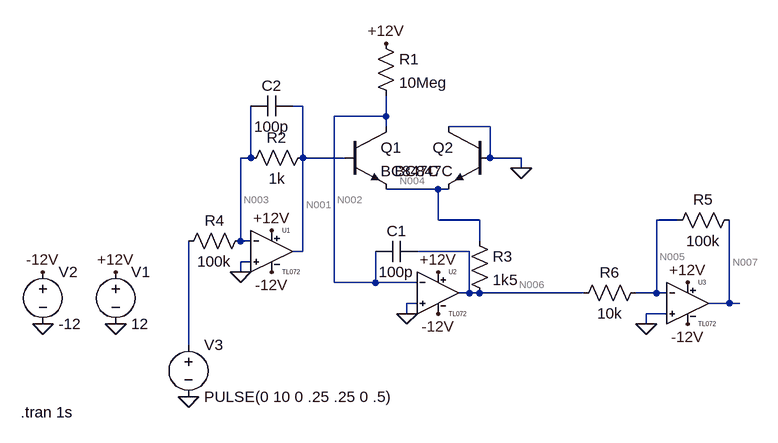
[diagram p0: schematic Draft2.asc]
Draft2.asc, the LTspice schematic file:
Version 4
SHEET 1 880 680
WIRE 32 -192 16 -192
WIRE 160 -176 160 -208
WIRE 160 -176 80 -176
WIRE 160 -160 160 -176
WIRE 320 -160 256 -160
WIRE -48 -112 -48 -192
WIRE -48 -112 -64 -112
WIRE 32 -112 32 -192
WIRE 96 -112 32 -112
WIRE 320 -112 320 -160
WIRE 368 -112 320 -112
WIRE 368 -96 368 -112
WIRE 240 -64 160 -64
WIRE 256 -64 240 -64
WIRE 240 -16 240 -64
WIRE 304 -16 240 -16
WIRE 608 -16 576 -16
WIRE -64 16 -64 -112
WIRE -48 16 -64 16
WIRE 304 16 304 -16
WIRE 32 32 32 -112
WIRE 32 32 16 32
WIRE 288 32 208 32
WIRE -48 48 -64 48
WIRE -64 64 -64 48
WIRE 80 80 80 -176
WIRE 144 80 144 32
WIRE 144 80 80 80
WIRE 208 80 144 80
WIRE 288 96 288 32
WIRE 288 96 272 96
WIRE 304 96 288 96
WIRE 464 96 304 96
WIRE 576 96 576 -16
WIRE 576 96 544 96
WIRE 592 96 576 96
WIRE 208 112 192 112
WIRE 688 112 688 -16
WIRE 688 112 656 112
WIRE 704 112 688 112
WIRE 192 128 192 112
WIRE 592 128 560 128
WIRE 560 144 560 128
WIRE -144 176 -144 16
FLAG -16 0 +12V
FLAG -16 64 -12V
FLAG -64 64 0
FLAG 240 64 +12V
FLAG 240 128 -12V
FLAG -256 144 0
FLAG -256 64 +12V
FLAG -368 64 -12V
FLAG -368 144 0
FLAG -144 256 0
FLAG 368 -96 0
FLAG 160 -288 +12V
FLAG 192 128 0
FLAG 560 144 0
FLAG 624 144 -12V
FLAG 624 80 +12V
SYMBOL TL072 -16 -32 R0
SYMATTR InstName U1
SYMBOL TL072 240 32 R0
SYMATTR InstName U2
SYMBOL voltage -256 48 R0
WINDOW 123 0 0 Left 0
WINDOW 39 0 0 Left 0
SYMATTR InstName V1
SYMATTR Value 12
SYMBOL voltage -368 48 R0
WINDOW 123 0 0 Left 0
WINDOW 39 0 0 Left 0
SYMATTR InstName V2
SYMATTR Value -12
SYMBOL voltage -144 160 R0
WINDOW 123 0 0 Left 0
WINDOW 39 0 0 Left 0
SYMATTR InstName V3
SYMATTR Value PULSE(0 10 0 .25 .25 0 .5)
SYMBOL npn 96 -160 R0
SYMATTR InstName Q1
SYMATTR Value BC847C
SYMBOL npn 320 -160 M0
SYMATTR InstName Q2
SYMATTR Value BC847C
SYMBOL res 144 -304 R0
SYMATTR InstName R1
SYMATTR Value 10Meg
SYMBOL res 48 -128 R90
WINDOW 0 0 56 VBottom 2
WINDOW 3 32 56 VTop 2
SYMATTR InstName R2
SYMATTR Value 1k
SYMBOL res 288 0 R0
SYMATTR InstName R3
SYMATTR Value 1k5
SYMBOL cap 208 16 R90
WINDOW 0 0 32 VBottom 2
WINDOW 3 32 32 VTop 2
SYMATTR InstName C1
SYMATTR Value 100p
SYMBOL cap 16 -208 R90
WINDOW 0 0 32 VBottom 2
WINDOW 3 32 32 VTop 2
SYMATTR InstName C2
SYMATTR Value 100p
SYMBOL res -48 0 R90
WINDOW 0 0 56 VBottom 2
WINDOW 3 32 56 VTop 2
SYMATTR InstName R4
SYMATTR Value 100k
SYMBOL TL072 624 48 R0
SYMATTR InstName U3
SYMBOL res 704 -32 R90
WINDOW 0 0 56 VBottom 2
WINDOW 3 32 56 VTop 2
SYMATTR InstName R5
SYMATTR Value 100k
SYMBOL res 560 80 R90
WINDOW 0 0 56 VBottom 2
WINDOW 3 32 56 VTop 2
SYMATTR InstName R6
SYMATTR Value 10k
TEXT -402 280 Left 2 !.tran 1s

The netlist it stands for:
* Draft2.asc
XU1 0 N003 +12V -12V N001 TL072  ; pins In+ In- V+ V- OUT
XU2 0 N002 +12V -12V N006 TL072  ; pins In+ In- V+ V- OUT
V1 +12V 0 12
V2 -12V 0 -12
V3 N008 0 PULSE(0 10 0 .25 .25 0 .5)
Q1 N002 N001 N004 0 BC847C
Q2 0 0 N004 0 BC847C
R1 +12V N002 10Meg
R2 N001 N003 1k
R3 N004 N006 1k5
C1 N006 N002 100p
C2 N001 N003 100p
R4 N003 N008 100k
XU3 0 N005 +12V -12V N007 TL072  ; pins In+ In- V+ V- OUT
R5 N007 N005 100k
R6 N005 N006 10k
.model NPN NPN
.model PNP PNP
.lib standard.bjt
.tran 1s
.lib TL072.sub
.backanno
.end

* Results of the author's LTspice run, read from the files saved beside the schematic
* Operating Point, zero values left out:
*   V(n001) = 11.12 µV
*   V(-12v) = -12 V
*   V(+12v) = 12 V
*   V(n003) = 10.97 µV
*   V(n006) = -459.7 mV
*   V(n002) = 13.04 µV
*   V(n004) = -456.1 mV
*   V(n007) = 4.597 V
*   V(n005) = -9.125 µV
*   Ic(Q2) = 1.199 µA
*   Ib(Q2) = 2.754 nA
*   Ie(Q2) = -1.202 µA
*   Ic(Q1) = 1.2 µA
*   Ib(Q1) = 2.755 nA
*   Ie(Q1) = -1.203 µA
*   I(R6) = 45.97 µA
*   I(R5) = 45.97 µA
*   I(R4) = 109.7 pA
*   I(R3) = 2.405 µA
*   I(R2) = 151.8 pA
*   I(R1) = 1.2 µA
*   I(V3) = 109.7 pA
*   I(V2) = 34.18 mA
*   I(V1) = -34.18 mA
*   Ix(u1:1) = 42.05 pA
*   Ix(u1:2) = 42.05 pA
*   Ix(u1:3) = 11.39 mA
*   Ix(u1:4) = -11.39 mA
*   Ix(u1:5) = -2.907 nA
*   Ix(u2:1) = 42.05 pA
*   Ix(u2:2) = 42.05 pA
*   Ix(u2:3) = 11.39 mA
*   Ix(u2:4) = -11.39 mA
*   Ix(u2:5) = 48.37 µA
*   Ix(u3:1) = 42.05 pA
*   Ix(u3:2) = 42.05 pA
*   Ix(u3:3) = 11.39 mA
*   Ix(u3:4) = -11.39 mA
*   Ix(u3:5) = -45.97 µA
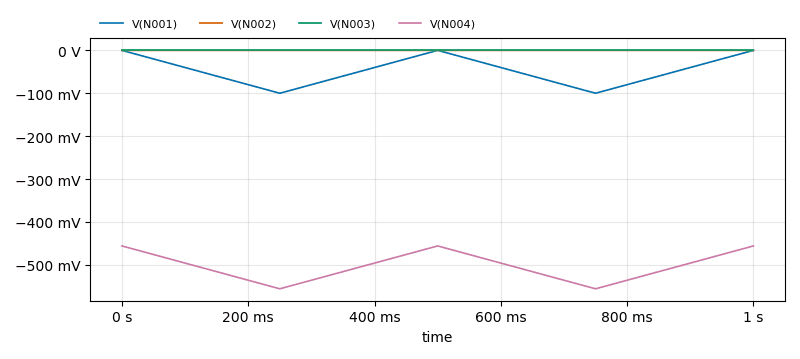
[diagram p1: Transient Analysis of Draft2.asc, plotted from the saved traces]
* Transient Analysis, 1 run:
*   V(N001): min -99.99 mV, max 11.12 µV, average -49.99 mV, rms 57.82 mV, last 11.06 µV
*   V(N002): min 13.02 µV, max 14.04 µV, average 13.37 µV, rms 13.38 µV, last 13.02 µV
*   V(N003): min 10.95 µV, max 11.56 µV, average 11.25 µV, rms 11.26 µV, last 10.95 µV
*   V(N004): min -556 mV, max -456.1 mV, average -506.1 mV, rms 506.9 mV, last -456.1 mV